# EAGLE design CSR8645-VFBGA275um-V2 (EAGLE 7.2.0)
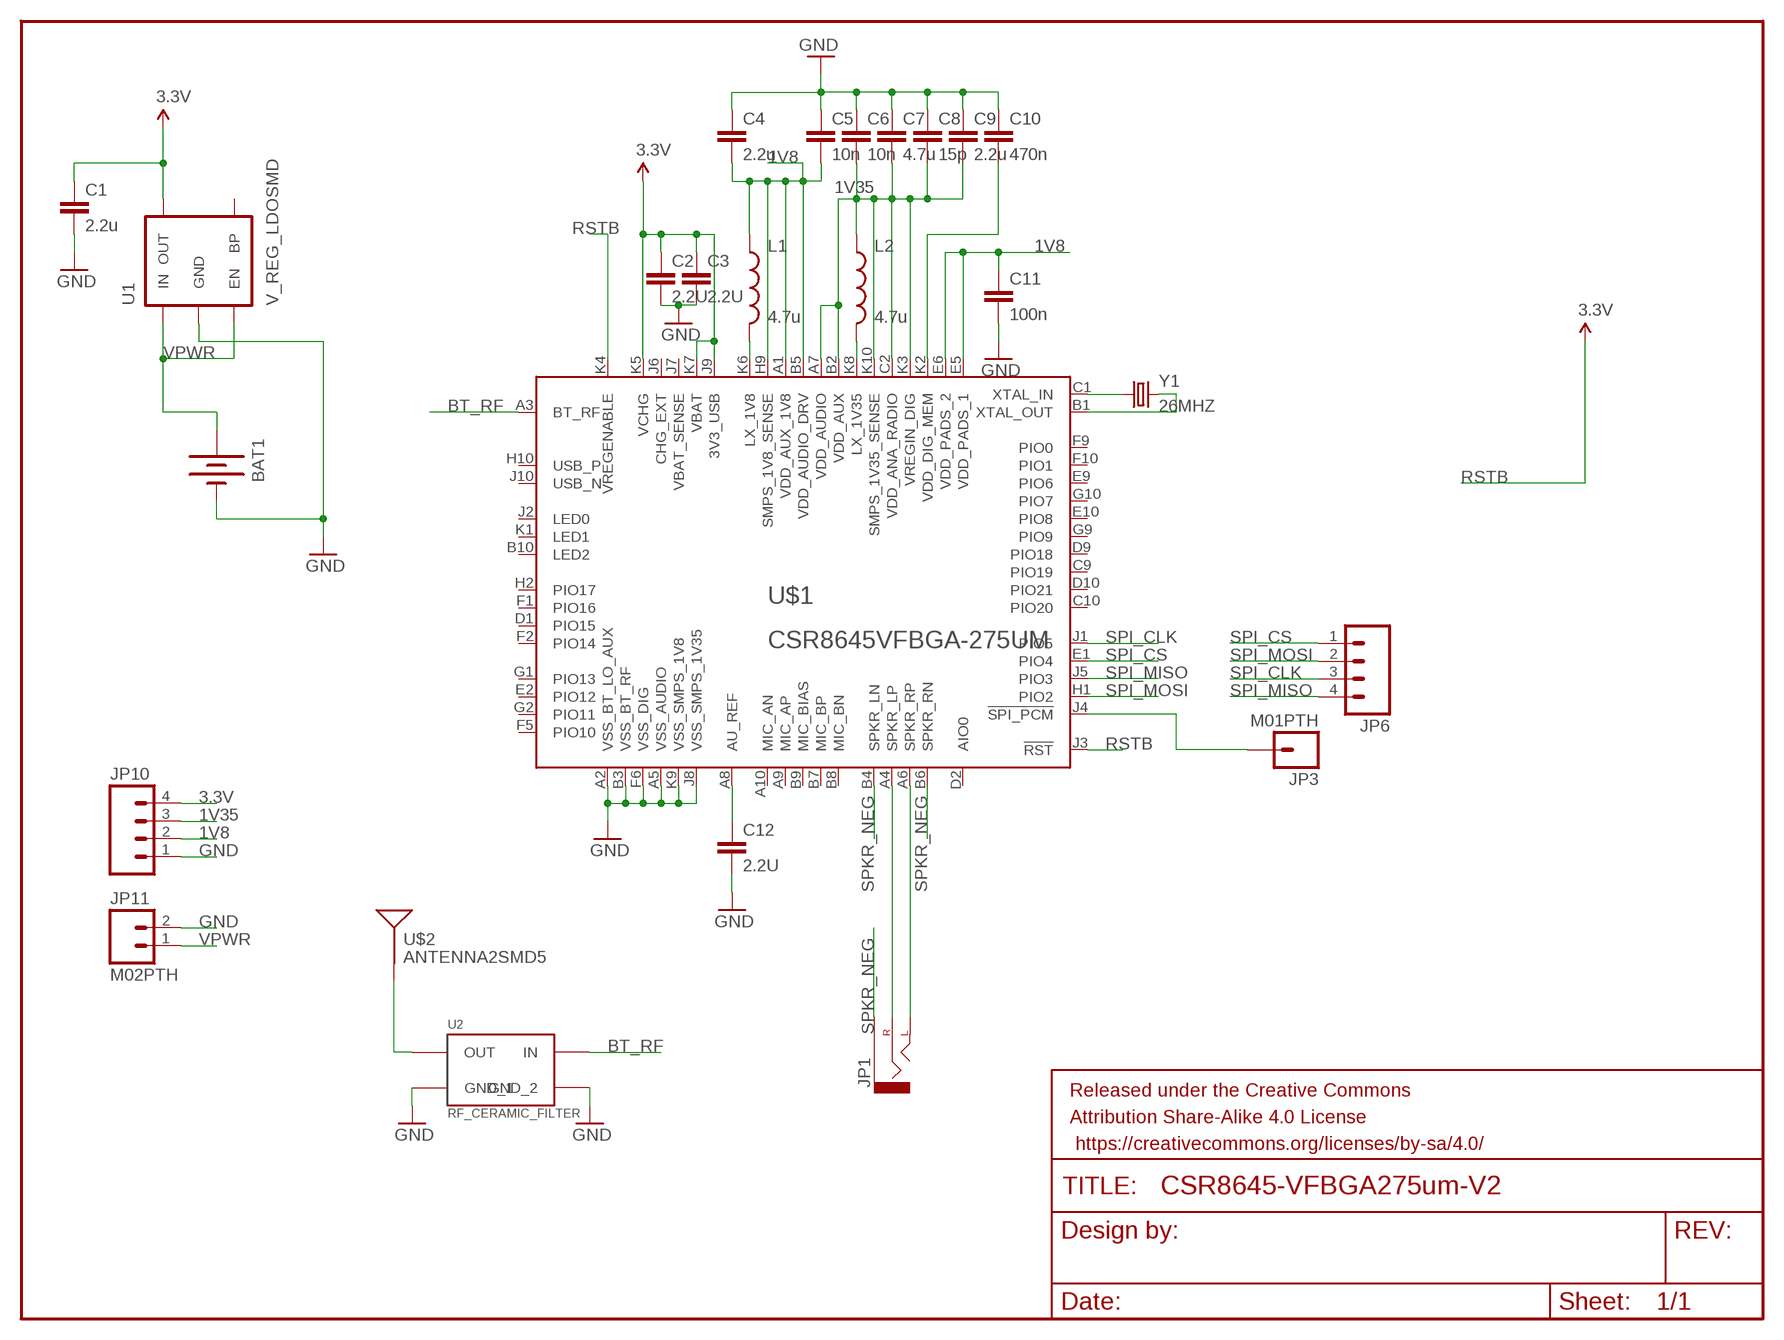
[diagram p0: schematic, sheet 1]

## Parts
BAT1  BATTERY9V  [BATTCON_9V]
C1  2.2u  CAP0603-CAP  [0603-CAP]
C2  2.2U  CAP0603-CAP  [0603-CAP]
C3  2.2U  CAP0603-CAP  [0603-CAP]
C4  2.2u  CAP0603-CAP  [0603-CAP]
C5  10n  CAP0603-CAP  [0603-CAP]
C6  10n  CAP0603-CAP  [0603-CAP]
C7  4.7u  CAP0603-CAP  [0603-CAP]
C8  15p  CAP0603-CAP  [0603-CAP]
C9  2.2u  CAP0603-CAP  [0603-CAP]
C10  470n  CAP0603-CAP  [0603-CAP]
C11  100n  CAP0603-CAP  [0603-CAP]
C12  2.2U  CAP0603-CAP  [0603-CAP]
FRAME1  FRAME-LETTER  [CREATIVE_COMMONS]
JP1  AUDIO-JACKSMD2  [AUDIO-JACK-3.5MM-SMD]
JP3  M01PTH  [1X01]
JP6  M04PTH  [1X04]
JP10  M04PTH  [1X04]
JP11  M02PTH  [1X02]
L1  4.7u  INDUCTOR0805  [0805]
L2  4.7u  INDUCTOR0805  [0805]
U1  V_REG_LDOSMD  [SOT23-5]
U2  RF_CERAMIC_FILTER  [RF_FILTER]
U$1  CSR8645VFBGA-275UM  [VFBGA68-LARGE]
U$2  ANTENNA2SMD5  [ANTENNA-CHIP5]
Y1  26MHZ  CRYSTALHC49US  [HC49US]

## Nets
1V8: C4.2 C5.2 C11.1 JP10.2 L1.1 U$1.A1(VDD_AUX_1V8) U$1.B5(VDD_AUDIO_DRV) U$1.E5(VDD_PADS_1) U$1.E6(VDD_PADS_2) U$1.H9(SMPS_1V8_SENSE)
1V35: C6.2 C7.2 C8.2 C9.2 JP10.3 L2.1 U$1.A7(VDD_AUDIO) U$1.B2(VDD_AUX) U$1.C2(VDD_ANA_RADIO) U$1.K3(VREGIN_DIG) U$1.K10(SMPS_1V35_SENSE)
3.3V: C1.1 C2.1 C3.1 JP10.4 U1.5(OUT) U$1.J9(3V3_USB) U$1.K5(VCHG) U$1.K7(VBAT)
!SPI_PCM: JP3.1 U$1.J4(!SPI_PCM)
BT_RF: U2.4(IN) U$1.A3(BT_RF)
GND: BAT1.- C1.2 C2.2 C3.2 C4.1 C5.1 C6.1 C7.1 C8.1 C9.1 C10.1 C11.2 C12.2 JP10.1 JP11.2 U1.2(GND) U2.1(GND_1) U2.3(GND_2) U$1.A2(VSS_BT_LO_AUX) U$1.A5(VSS_AUDIO) U$1.B3(VSS_BT_RF) U$1.F6(VSS_DIG) U$1.J8(VSS_SMPS_1V35) U$1.K9(VSS_SMPS_1V8)
N$2: JP1.RING(RIGHT) U$1.A4(SPKR_LP)
N$3: L1.2 U$1.K6(LX_1V8)
N$4: L2.2 U$1.K8(LX_1V35)
N$5: U$1.C1(XTAL_IN) Y1.1
N$6: C10.2 U$1.K2(VDD_DIG_MEM)
N$7: U$1.B1(XTAL_OUT) Y1.2
N$8: JP1.TIP(LEFT) U$1.A6(SPKR_RP)
N$13: U2.2(OUT) U$2.FEED(SIGNAL)
N$15: C12.1 U$1.A8(AU_REF)
RSTB: U$1.J3(!RST) U$1.K4(VREGENABLE) ; supply symbol labelled 3.3V
SPI_CLK: JP6.3 U$1.J1(PIO5)
SPI_CS: JP6.1 U$1.E1(PIO4)
SPI_MISO: JP6.4 U$1.J5(PIO3)
SPI_MOSI: JP6.2 U$1.H1(PIO2)
SPKR_NEG: JP1.SLEEVE U$1.B4(SPKR_LN) U$1.B6(SPKR_RN)
VPWR: BAT1.+ JP11.1 U1.1(IN) U1.3(EN)
Unconnected: U1.4(BP) U$1.A9(MIC_AP) U$1.A10(MIC_AN) U$1.B7(MIC_BP) U$1.B8(MIC_BN) U$1.B9(MIC_BIAS) U$1.B10(LED2) U$1.C9(PIO19) U$1.C10(PIO20) U$1.D1(PIO15) U$1.D2(AIO0) U$1.D9(PIO18) U$1.D10(PIO21) U$1.E2(PIO12) U$1.E9(PIO6) U$1.E10(PIO8) U$1.F1(PIO16) U$1.F2(PIO14) U$1.F5(PIO10) U$1.F9(PIO0) U$1.F10(PIO1) U$1.G1(PIO13) U$1.G2(PIO11) U$1.G9(PIO9) U$1.G10(PIO7) U$1.H2(PIO17) U$1.H10(USB_P) U$1.J2(LED0) U$1.J6(CHG_EXT) U$1.J7(VBAT_SENSE) U$1.J10(USB_N) U$1.K1(LED1)

## Library data of the parts
BAT1 = SparkFun-Electromechanical:BATTERY: Battery Holders Various common sizes : AA, AAA, 18650 (PRT-12895), 20mm coin cell and 12mm coin cell. 20MM_4LEGS, BATT-10373
C1-C12 = SparkFun-Passives:CAP: Capacitor Standard 0603 ceramic capacitor, and 0.1" leaded capacitor.
FRAME1 = SparkFun-Aesthetics:FRAME-LETTER: Schematic Frame Standard 8.5x11 US Letter frame
JP1 = SparkFun-Connectors:AUDIO-JACK: 3.5mm Audio Jack Simple 3.5mm common PCB mount audio jack. SKU: PRT-08032; PROD_ID: CONN-10353
JP3 = SparkFun-Connectors:M01: Header 1 Standard 1-pin 0.1" header. Use with straight break away headers (SKU : PRT-00116), right angle break away headers (PRT-00553), swiss pins (PRT-00743), machine pins (PRT-00117), and female headers (PRT-00115).
JP6 JP10 = SparkFun-Connectors:M04: Header 4 Standard 4-pin 0.1" header. Use with straight break away headers (SKU : PRT-00116), right angle break away headers (PRT-00553), swiss pins (PRT-00743), machine pins (PRT-00117), and female headers (PRT-00115). Molex polarized connector foot print use with SKU : PRT-08231 with associated crimp pins and housings. 1MM SMD Version SKU: PRT-10208
JP11 = SparkFun-Connectors:M02: Standard 2-pin 0.1" header. Use with - straight break away headers ( PRT-00116) - right angle break away headers (PRT-00553) - swiss pins (PRT-00743) - machine pins (PRT-00117) - female headers (PRT-00115) Molex polarized connector foot print use with: PRT-08233 with associated crimp pins and housings. 2.54_SCREWTERM for use with PRT-10571. 3.5mm Screw Terminal footprints for PRT-08084 5mm Screw Terminal footprints for use with PRT-08432
L1 L2 = SparkFun-Passives:INDUCTOR: Inductors Basic Inductor/Choke - 0603 and 1206. Footprints are not proven and vary greatly between part numbers. SRN6045- 33uH, 20% 1.4A SDR0403-560KL - 56uH, 10%, 500mA RMS/740mA peak
U1 = SparkFun-PowerIC:V_REG_LDO: Voltage Regulator LDO Standard 150mA LDO voltage regulator in SOT-23 layout. Micrel part MIC5205. BP (by-pass) pin is used to lower output noise with 470pF cap.
U2 = SparkFun-RF:RF_CERAMIC_FILTER
U$1 = SparkFun-DigitalIC:CSR8645
U$2 = SparkFun-RF:ANTENNA2: Chip antenna Single endded antenna. Common with smaller chip antennas. CHIP4 package is the GPS Chip Antenna SKU: GPS-08418. CHIP5 package is 2.4GHz chip antenna SKU: WRL-00144.
Y1 = SparkFun-FreqCtrl:CRYSTAL: Various standard crystals. Proven footprints.

## Board
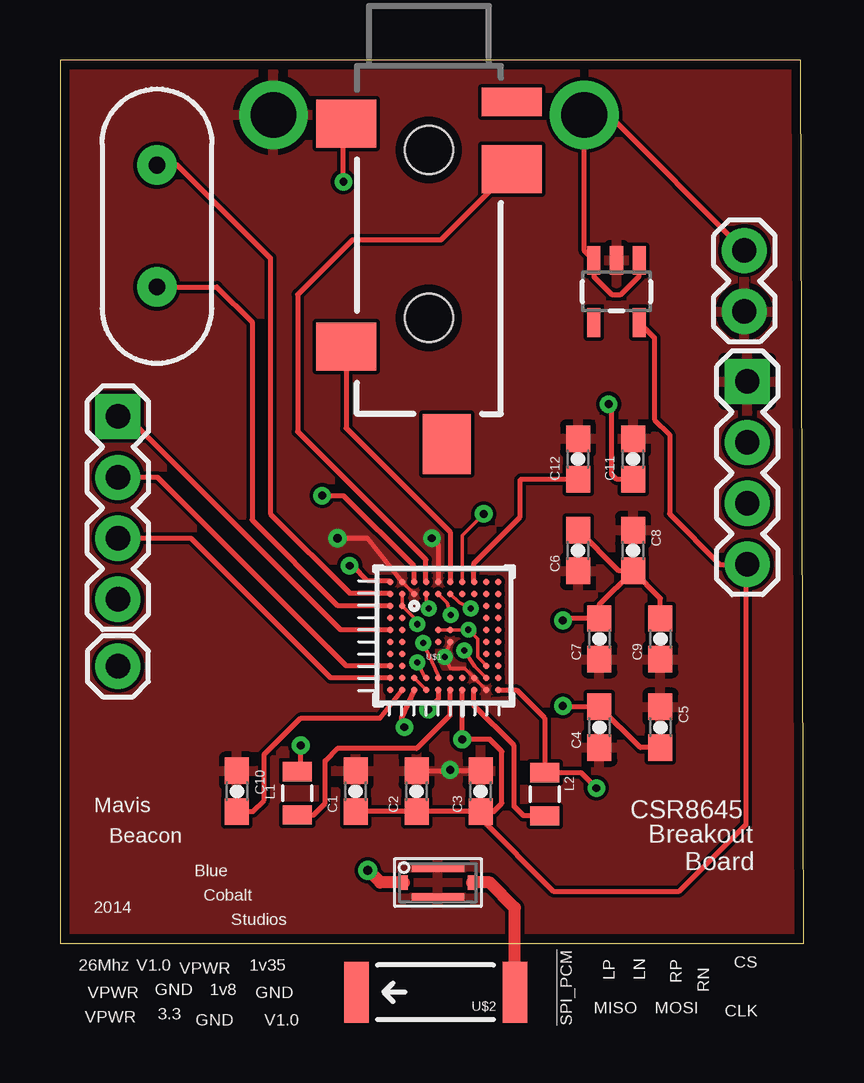
[diagram p1: board, top side]
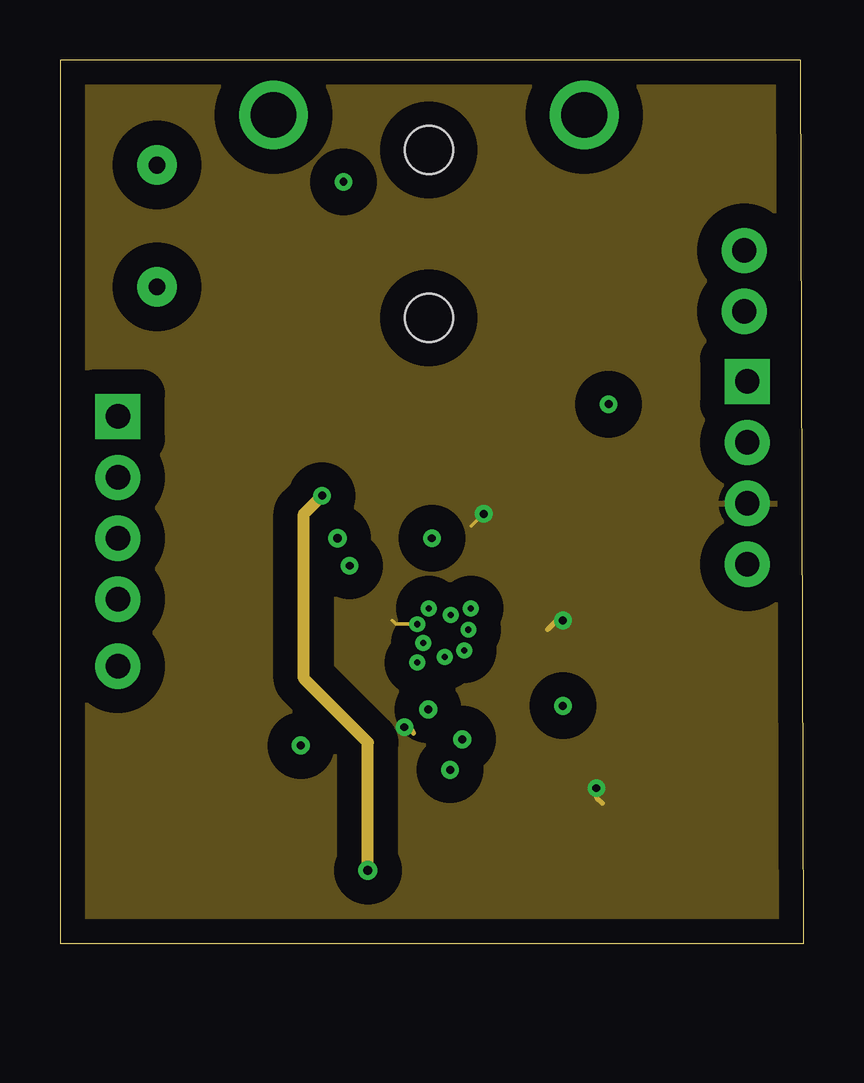
[diagram p2: board, inner layer Route2]
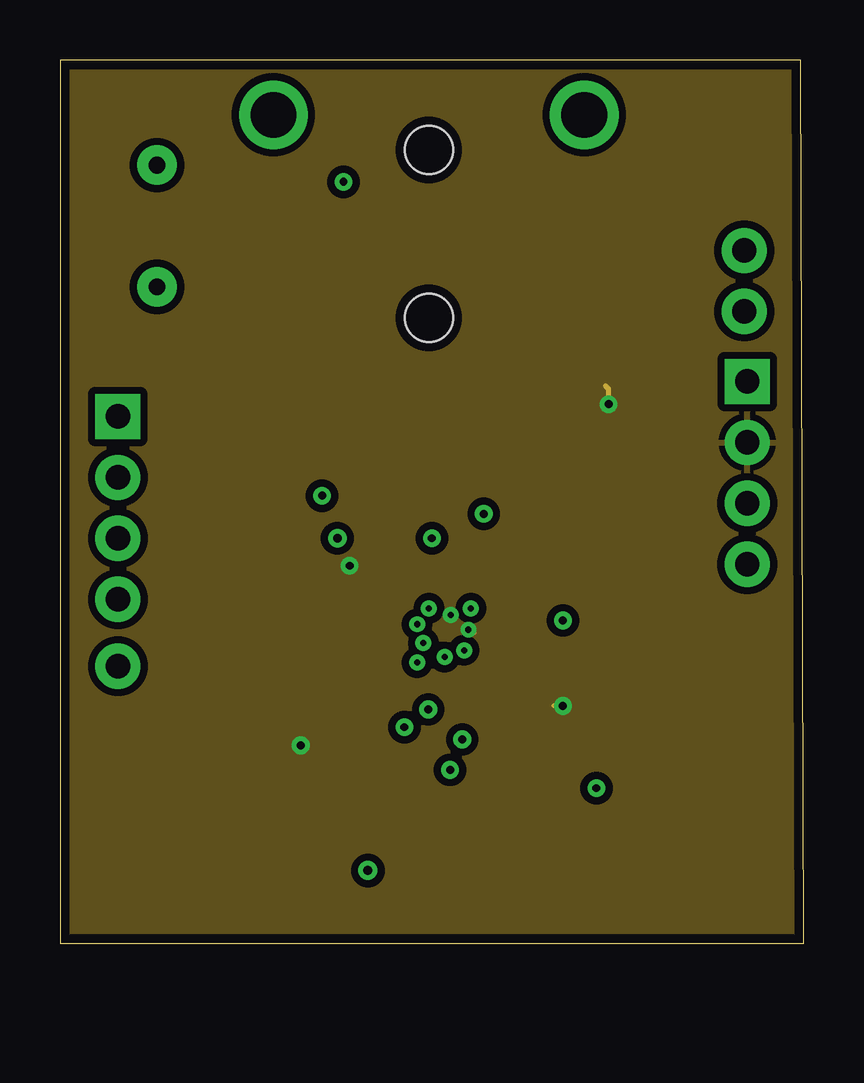
[diagram p3: board, inner layer Route15]
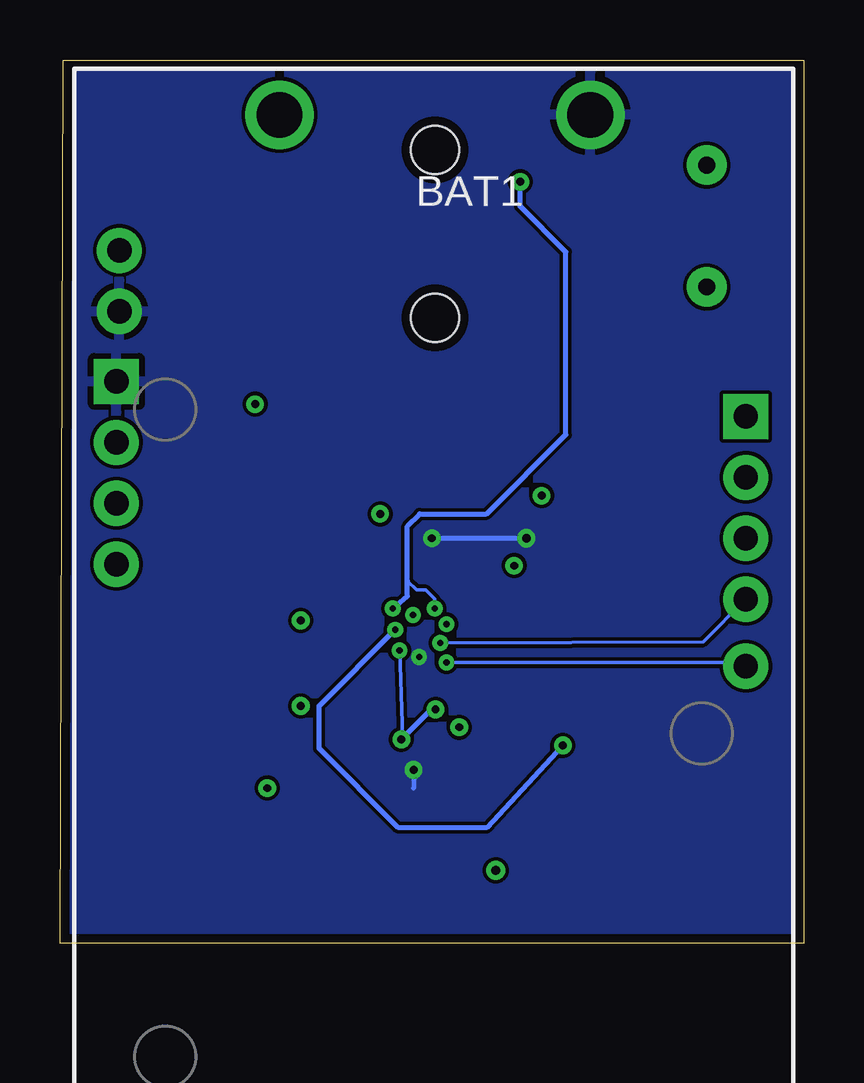
[diagram p4: board, bottom side, seen from below]

Size 30.99 x 36.83 mm. Coordinates in mm from the lower left corner, seen from the top.
Outline: 0,0 30.99,0 30.86,36.83 0,36.83 0,0
Copper layers (1*2*15*16): Top 0.035559375mm / dielectric 0.17018125mm / Route2 0.01778125mm / dielectric 47mil / Route15 0.01778125mm / dielectric 0.17018125mm / Bottom 0.035559375mm
Design rules "OSHPark-4layer *": minimum track width 6mil, minimum drill 10mil, track to track 6mil, track to pad 5mil, pad to pad 5mil, via to via 5mil, smd to smd 5mil, copper to edge 15mil, drill to drill 6mil, minimum pad ring 4mil, minimum via ring 8mil, stop-mask expansion 4mil, vias tented up to drill 0mil, thermal gap 10mil

### Footprints (pad centres in the part's own frame; a part is rotated, then mirrored left to right if it is on the bottom)
BATTCON_9V = drill 1.905: + 0,0; - 0,-12.954
0603-CAP = smd 1.1 x 1: 1 -0.85,0; 2 0.85,0
AUDIO-JACK-3.5MM-SMD = smd 2 x 2.5: RING 4.3,3.45; SLEEVE 2.4,-3.45; TIP 11.7,-3.45 | smd 1.2 x 2.5: RSH 1.5,3.45 | smd 2.5 x 2: TSH 15.75,0.75 | hole 2: 3.5,0; 10.5,0
1X01 = drill 1.016 pad 1.88: 1 0,0
1X04 = drill 1.016 pad 1.88 square: 1 0,0 | drill 1.016 pad 1.88: 2 2.54,0; 3 5.08,0; 4 7.62,0
1X02 = drill 1.016 pad 1.88: 1 0,0; 2 2.54,0
0805 = smd 0.8 x 1.2: 1 -0.9,0; 2 0.9,0
SOT23-5 = smd 0.55 x 1.2: 1 -0.95,-1.3; 2 0,-1.3; 3 0.95,-1.3; 4 0.95,1.3; 5 -0.95,1.3
RF_FILTER = smd 2.2 x 0.35: 1 0,0.625; 3 0,-0.625 | smd 0.35 x 0.6: 2 1.425,0; 4 -1.425,0
VFBGA68-LARGE = smd 0.275 x 0.275: A1 -2.25,2.25; A2 -1.75,2.25; A3 -1.25,2.25; A4 -0.75,2.25; A5 -0.25,2.25; A6 0.25,2.25; A7 0.75,2.25; A8 1.25,2.25; A9 1.75,2.25; A10 2.25,2.25; B1 -2.25,1.75; B2 -1.75,1.75; B3 -1.25,1.75; B4 -0.75,1.75; B5 -0.25,1.75; B6 0.25,1.75; B7 0.75,1.75; B8 1.25,1.75; B9 1.75,1.75; B10 2.25,1.75; C1 -2.25,1.25; C2 -1.75,1.25; C9 1.75,1.25; C10 2.25,1.25; D1 -2.25,0.75; D2 -1.75,0.75; D9 1.75,0.75; D10 2.25,0.75; E1 -2.25,0.25; E2 -1.75,0.25; E5 -0.25,0.25; E6 0.25,0.25; E9 1.75,0.25; E10 2.25,0.25; F1 -2.25,-0.25; F2 -1.75,-0.25; F5 -0.25,-0.25; F6 0.25,-0.25; F9 1.75,-0.25; F10 2.25,-0.25; G1 -2.25,-0.75; G2 -1.75,-0.75; G9 1.75,-0.75; G10 2.25,-0.75; H1 -2.25,-1.25; H2 -1.75,-1.25; H9 1.75,-1.25; H10 2.25,-1.25; J1 -2.25,-1.75; J2 -1.75,-1.75; J3 -1.25,-1.75; J4 -0.75,-1.75; J5 -0.25,-1.75; J6 0.25,-1.75; J7 0.75,-1.75; J8 1.25,-1.75; J9 1.75,-1.75; J10 2.25,-1.75; K1 -2.25,-2.25; K2 -1.75,-2.25; K3 -1.25,-2.25; K4 -0.75,-2.25; K5 -0.25,-2.25; K6 0.25,-2.25; K7 0.75,-2.25; K8 1.25,-2.25; K9 1.75,-2.25; K10 2.25,-2.25
ANTENNA-CHIP5 = smd 1.016 x 2.54: FEED -3.302,0; NC 3.302,0
HC49US = drill 0.7 pad 1.651: 1 -2.54,0; 2 2.54,0

### Placement (x,y rotation side)
BAT1  21.84,34.54 90 bottom
C1  12.32,6.35 90 top
C2  14.86,6.35 90 top
C3  17.53,6.35 90 top
C4  22.48,9.02 90 top
C5  25.02,9.02 270 top
C6  21.59,16.38 90 top
C7  22.48,12.7 90 top
C8  23.88,16.38 270 top
C9  25.02,12.7 90 top
C10  7.37,6.35 270 top
C11  23.88,20.19 90 top
C12  21.59,20.19 90 top
FRAME1  120.65,78.87 0 top  (outside the outline)
JP1  15.37,36.58 270 top
JP3  2.41,11.56 0 top
JP6  2.41,21.97 270 top
JP10  28.64,23.43 270 top
JP11  28.51,28.89 270 top
L1  9.88,6.26 270 top
L2  20.19,6.22 270 top
U1  23.19,27.18 180 top
U2  15.75,2.54 0 top
U$1  16,12.83 0 top
U$2  15.65,-2.03 180 top
Y1  4.04,29.91 90 top

### Tracks (layer width: path | path; a pad name or v marks a point on that pad's centre or on a via)
1V8  (via drill 0.25, 0.33)
  Top 0.152: U$1.H9 17.4,11.94 17.4,12.7 v17.02,13.08 | U$1.E6 | U$1.E6 U$1.E5 | 17.27,12.95 17.14,13.08 v17.02,13.08 | U$1.E6 v17.01,13.08 v17.02,13.08 | U$1.B5 16.13,14.2 v16.28,13.69
  Top 0.203: C5.2 24.18,8.17 C4.2 20.99,9.87 v20.95,9.91 | C11.1 23.2,19.34 22.99,19.56 22.99,22.35 v22.86,22.48 | L1.1 10.03,7.31 v10.03,8.26 | U$1.A1 13.72,15.11 12.83,15.11 12.19,15.75 v12.06,15.75
  Route15 0.152: v17.02,13.08 17.14,13.08 17.27,12.95
  Route15 0.203: v20.95,9.91 20.57,9.91 | v22.86,22.48 22.86,23.11 22.73,23.24
  Bottom 0.203: v10.03,8.26 13.21,4.83 16.89,4.83 20.19,8.13 20.19,9.91 v17.02,13.08
  pour Route15 (isolate 0.305): 0,36.83 30.86,36.83 30.99,0.13 0,0.13
1V35  (via drill 0.25, 0.33)
  Top 0.152: U$1.B2 U$1.C2 | U$1.C2 | U$1.A7 16.75,17.01 v17.65,17.91 | v14.88,13.31 14.88,13.44 U$1.C2
  Top 0.203: C8.2 22.48,14.14 C7.2 21.04,13.55 v20.95,13.46 | C9.2 25.02,14.39 C8.2 | C8.2 23.29,15.53 C6.2 | U$1.K3 14.22,9.4 14.22,9.02 v14.35,9.02 | v22.35,6.48 21.71,7.12 L2.1 20.19,9.4 19.05,10.54 18.29,10.54 U$1.K10
  Route2 0.152: v17.65,17.91 17.14,17.4 | v14.88,13.31 13.99,13.31 13.84,13.46
  Route2 0.203: v20.95,13.46 20.7,13.46 20.32,13.08 | v14.35,9.02 14.61,9.02 14.73,8.76 | v22.35,6.48 22.35,6.1 22.61,5.84
  pour Route2 (isolate 1.016): 0,36.83 30.86,36.83 30.86,0.13 0,0.13
3.3V  (via drill 0.25, 0.33)
  Top 0.152: U$1.J9 17.27,11.56 v16.84,12.22
  Top 0.203: U1.5 24.77,25.25 24.77,21.84 25.4,21.21 25.4,17.91 27.5,15.81 JP10.4 28.57,15.75 28.57,4.95 25.78,2.16 20.57,2.16 17.53,5.21 | 17.53,5.21 C3.1 | 17.53,5.21 17.23,5.5 | 17.23,5.5 C2.1 C1.1 | C3.1 17.23,5.5 | U$1.K7 16.76,10.56 v16.76,8.51 17.91,8.51 18.41,8 18.41,5.84 18.07,5.5 C3.1 | U$1.K5 15.75,10.16 v15.34,9.75
  Bottom 0.152: 16.71,8.56 v16.84,12.22
  Bottom 0.203: v15.34,9.75 15.62,9.65 16.71,8.56 v16.76,8.51
!SPI_PCM  (via drill 0.25)
  Top 0.152: U$1.J4 15.21,11.08 v14.88,11.71
  Bottom 0.152: v14.88,11.71 2.56,11.71 JP3.1
BT_RF  (via drill 0.33, 0.38)
  Top 0.203: v10.92,18.67 11.81,18.67 14.73,15.75 14.73,15.1 U$1.A3
  Top 0.508: U2.4 13.34,2.54 v12.83,3.05
  Route2 0.508: v12.83,3.05 12.83,8.38 10.16,11.05 10.16,17.91 v10.92,18.67
GND  (via drill 0.25, 0.33, 0.36)
  Top 0.152: U$1.K9 U$1.J8 16.87,11.46 16.26,11.46 v16.03,11.94 U$1.F6 | U$1.B3 U$1.A2
  Top 0.203: C2.2 16.22,7.2 v16.26,7.24 16.3,7.2 C3.2 | U$1.A2 12.82,16.89 v11.56,16.89 | v15.49,16.89 15.75,16.63 U$1.A5
  Bottom 0.152: v16.03,11.94 16.13,11.68
  Bottom 0.203: v16.26,7.24 16.26,6.48 | v11.56,16.89 v15.49,16.89
  pour Top (isolate 0.152): 0,36.83 30.99,36.83 30.99,0.13 0,0.13
  pour Bottom (isolate 0.152): 0,36.83 30.99,36.83 30.99,0.13 0,0.13
N$2
  Top 0.203: U$1.A4 15.24,15.09 15.24,16 9.91,21.34 9.91,27.05 12.19,29.34 15.88,29.34 JP1.RING
N$3
  Top 0.203: L1.2 10.57,5.36 11.05,5.84 11.05,7.62 11.56,8.13 14.86,8.13 16.26,9.53 U$1.K6
N$4
  Top 0.203: L2.2 19.32,5.32 18.92,5.71 18.92,8.26 17.25,9.93 U$1.K8
N$5
  Top 0.203: Y1.1 6.54,27.37 8,25.91 8,17.65 11.56,14.1 13.73,14.1 U$1.C1
N$6
  Top 0.203: C10.2 8.04,5.5 8.51,5.97 8.51,7.87 10.03,9.4 13.34,9.4 U$1.K2 14.22,10.55
N$7
  Top 0.203: Y1.2 4.89,32.45 8.76,28.58 8.76,17.91 12.06,14.6 13.72,14.6 U$1.B1
N$8
  Top 0.203: JP1.TIP 11.92,21.48 16.26,17.15 U$1.A6
N$13
  Top 0.508: U$2.FEED 18.95,1.5 17.91,2.54 U2.2
N$15
  Top 0.203: C12.1 19.22,19.34 19.18,19.3 19.18,17.78 17.25,15.85 U$1.A8
RSTB
  Top 0.152: U$1.K4 U$1.J3
SPI_CLK
  Top 0.203: U$1.J1 11.28,11.08 5.46,16.89 JP6.3
SPI_CS
  Top 0.203: U$1.E1 11.69,13.08 3.05,21.72 2.67,21.72 JP6.1
SPI_MISO  (via drill 0.25)
  Top 0.152: U$1.J5 15.75,11.17 v15.14,12.52 15.29,12.37
  Bottom 0.152: v15.14,12.52 4.19,12.57 JP6.4
SPI_MOSI
  Top 0.203: U$1.H1 11.92,11.58 4.06,19.43 JP6.2
SPKR_NEG  (via drill 0.25, 0.33)
  Top 0.152: U$1.B6 16.63,14.22 v17.12,13.97 | U$1.B4 15.25,14.08 v15.37,13.97
  Top 0.203: v11.81,31.75 11.81,33.4 11.92,33.51 JP1.SLEEVE
  Bottom 0.152: v15.37,13.97 15.37,14.35 15.75,14.73 16.13,14.73 16.51,15.11
  Bottom 0.203: v11.81,31.75 11.81,30.73 9.91,28.83 9.91,21.21 13.21,17.91 16,17.91 16.51,17.4 16.51,15.11 16.51,14.48 v17.12,13.97
VPWR
  Top 0.203: JP11.1 22.86,34.54 BAT1.+ 21.84,28.87 U1.3 22.24,27.8 22.99,27.05 23.37,27.05 24.13,27.81 U1.1

### Text on the board
tPlace: Mavis | CSR8645 | Beacon | Breakout | Blue | Board | Cobalt | 2014 | Studios | 26Mhz | V1.0 | VPWR | 1v35 | CS | GND | 1v8 | LP | LN | RP | RN | VPWR | VPWR | 3.3 | GND | GND | MISO | MOSI | CLK | V1.0 | !SPI_PCM